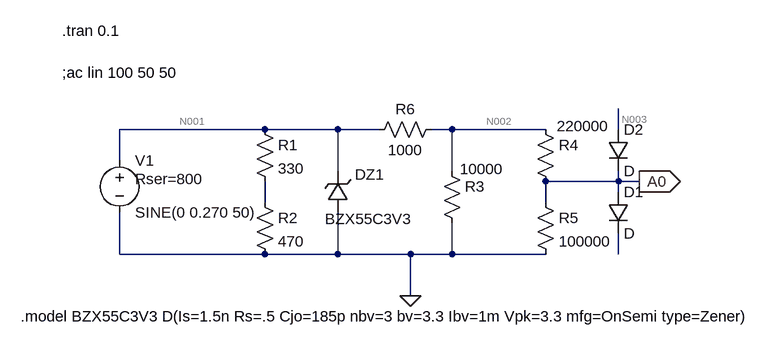
[diagram p0: schematic TA12.asc]
TA12.asc, the LTspice schematic file:
Version 4
SHEET 1 888 680
WIRE 96 -528 -128 -528
WIRE 208 -528 96 -528
WIRE 272 -528 208 -528
WIRE 384 -528 352 -528
WIRE 528 -528 384 -528
WIRE 640 -528 640 -560
WIRE -128 -480 -128 -528
WIRE 208 -464 208 -528
WIRE 384 -464 384 -528
WIRE 640 -448 640 -464
WIRE 640 -448 528 -448
WIRE 672 -448 640 -448
WIRE 640 -432 640 -448
WIRE 96 -416 96 -448
WIRE 528 -416 528 -448
WIRE -128 -336 -128 -400
WIRE 96 -336 -128 -336
WIRE 208 -336 208 -400
WIRE 208 -336 96 -336
WIRE 320 -336 208 -336
WIRE 384 -336 384 -384
WIRE 384 -336 320 -336
WIRE 528 -336 384 -336
WIRE 640 -336 640 -368
WIRE 320 -272 320 -336
FLAG 320 -272 0
FLAG 672 -448 A0
IOPIN 672 -448 Out
SYMBOL res 80 -544 R0
SYMATTR InstName R1
SYMATTR Value 330
SYMBOL res 80 -432 R0
SYMATTR InstName R2
SYMATTR Value 470
SYMBOL res 368 -480 R0
WINDOW 3 28 13 Left 2
SYMATTR Value 10000
SYMATTR InstName R3
SYMBOL res 512 -544 R0
WINDOW 3 33 11 Left 2
SYMATTR Value 220000
SYMATTR InstName R4
SYMBOL res 512 -432 R0
SYMATTR InstName R5
SYMATTR Value 100000
SYMBOL res 368 -544 R90
WINDOW 0 0 56 VBottom 2
WINDOW 3 32 56 VTop 2
SYMATTR InstName R6
SYMATTR Value 1000
SYMBOL zener 224 -400 R180
WINDOW 0 -56 59 Left 2
WINDOW 3 -98 -10 Left 2
SYMATTR InstName DZ1
SYMATTR Value BZX55C3V3
SYMBOL voltage -128 -496 R0
WINDOW 123 0 0 Left 0
WINDOW 39 24 44 Left 2
SYMATTR SpiceLine Rser=800
SYMATTR InstName V1
SYMATTR Value SINE(0 0.270 50)
SYMBOL diode 624 -432 R0
SYMATTR InstName D1
SYMBOL diode 624 -528 R0
SYMATTR InstName D2
TEXT -280 -240 Left 2 !.model BZX55C3V3 D(Is=1.5n Rs=.5 Cjo=185p nbv=3 bv=3.3 Ibv=1m Vpk=3.3 mfg=OnSemi type=Zener)
TEXT -216 -616 Left 2 !;ac lin 100 50 50
TEXT -216 -680 Left 2 !.tran 0.1

The netlist it stands for:
* TA12.asc
R1 N001 N004 330
R2 N004 0 470
R3 N002 0 10000
R4 N002 A0 220000
R5 A0 0 100000
R6 N002 N001 1000
DZ1 0 N001 BZX55C3V3
V1 N001 0 SINE(0 0.270 50) Rser=800
D1 A0 N005 D
D2 N003 A0 D
.model D D
.lib standard.dio
.model BZX55C3V3 D(Is=1.5n Rs=.5 Cjo=185p nbv=3 bv=3.3 Ibv=1m Vpk=3.3 mfg=OnSemi type=Zener)
;ac lin 100 50 50
.tran 0.1
.backanno
.end

* Results of the author's LTspice run, read from the files saved beside the schematic
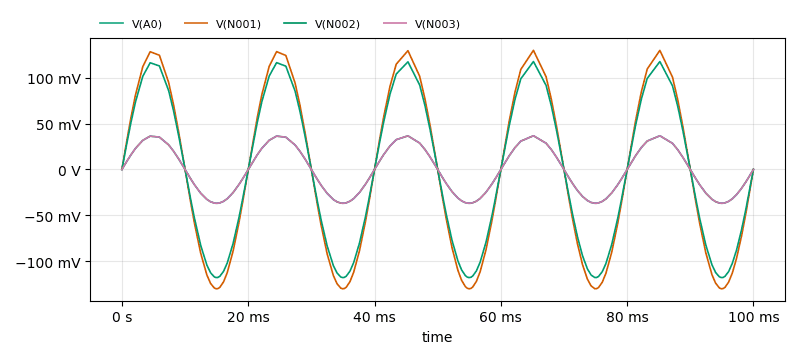
[diagram p1: Transient Analysis of TA12.asc, plotted from the saved traces]
* Transient Analysis, 1 run:
*   V(A0): min -36.83 mV, max 36.77 mV, average -151.7 µV, rms 25.88 mV, last -826 nV
*   V(N001): min -130 mV, max 129.8 mV, average -535.6 µV, rms 91.37 mV, last -2.916 µV
*   V(N002): min -117.9 mV, max 117.7 mV, average -485.4 µV, rms 82.81 mV, last -2.643 µV
*   V(N003): min -36.83 mV, max 36.77 mV, average -151.7 µV, rms 25.88 mV, last -826 nV